# Altium schematic sheet 02_power.SchDoc: Power
size A3; SheetNumber: 3; SheetTotal: 10
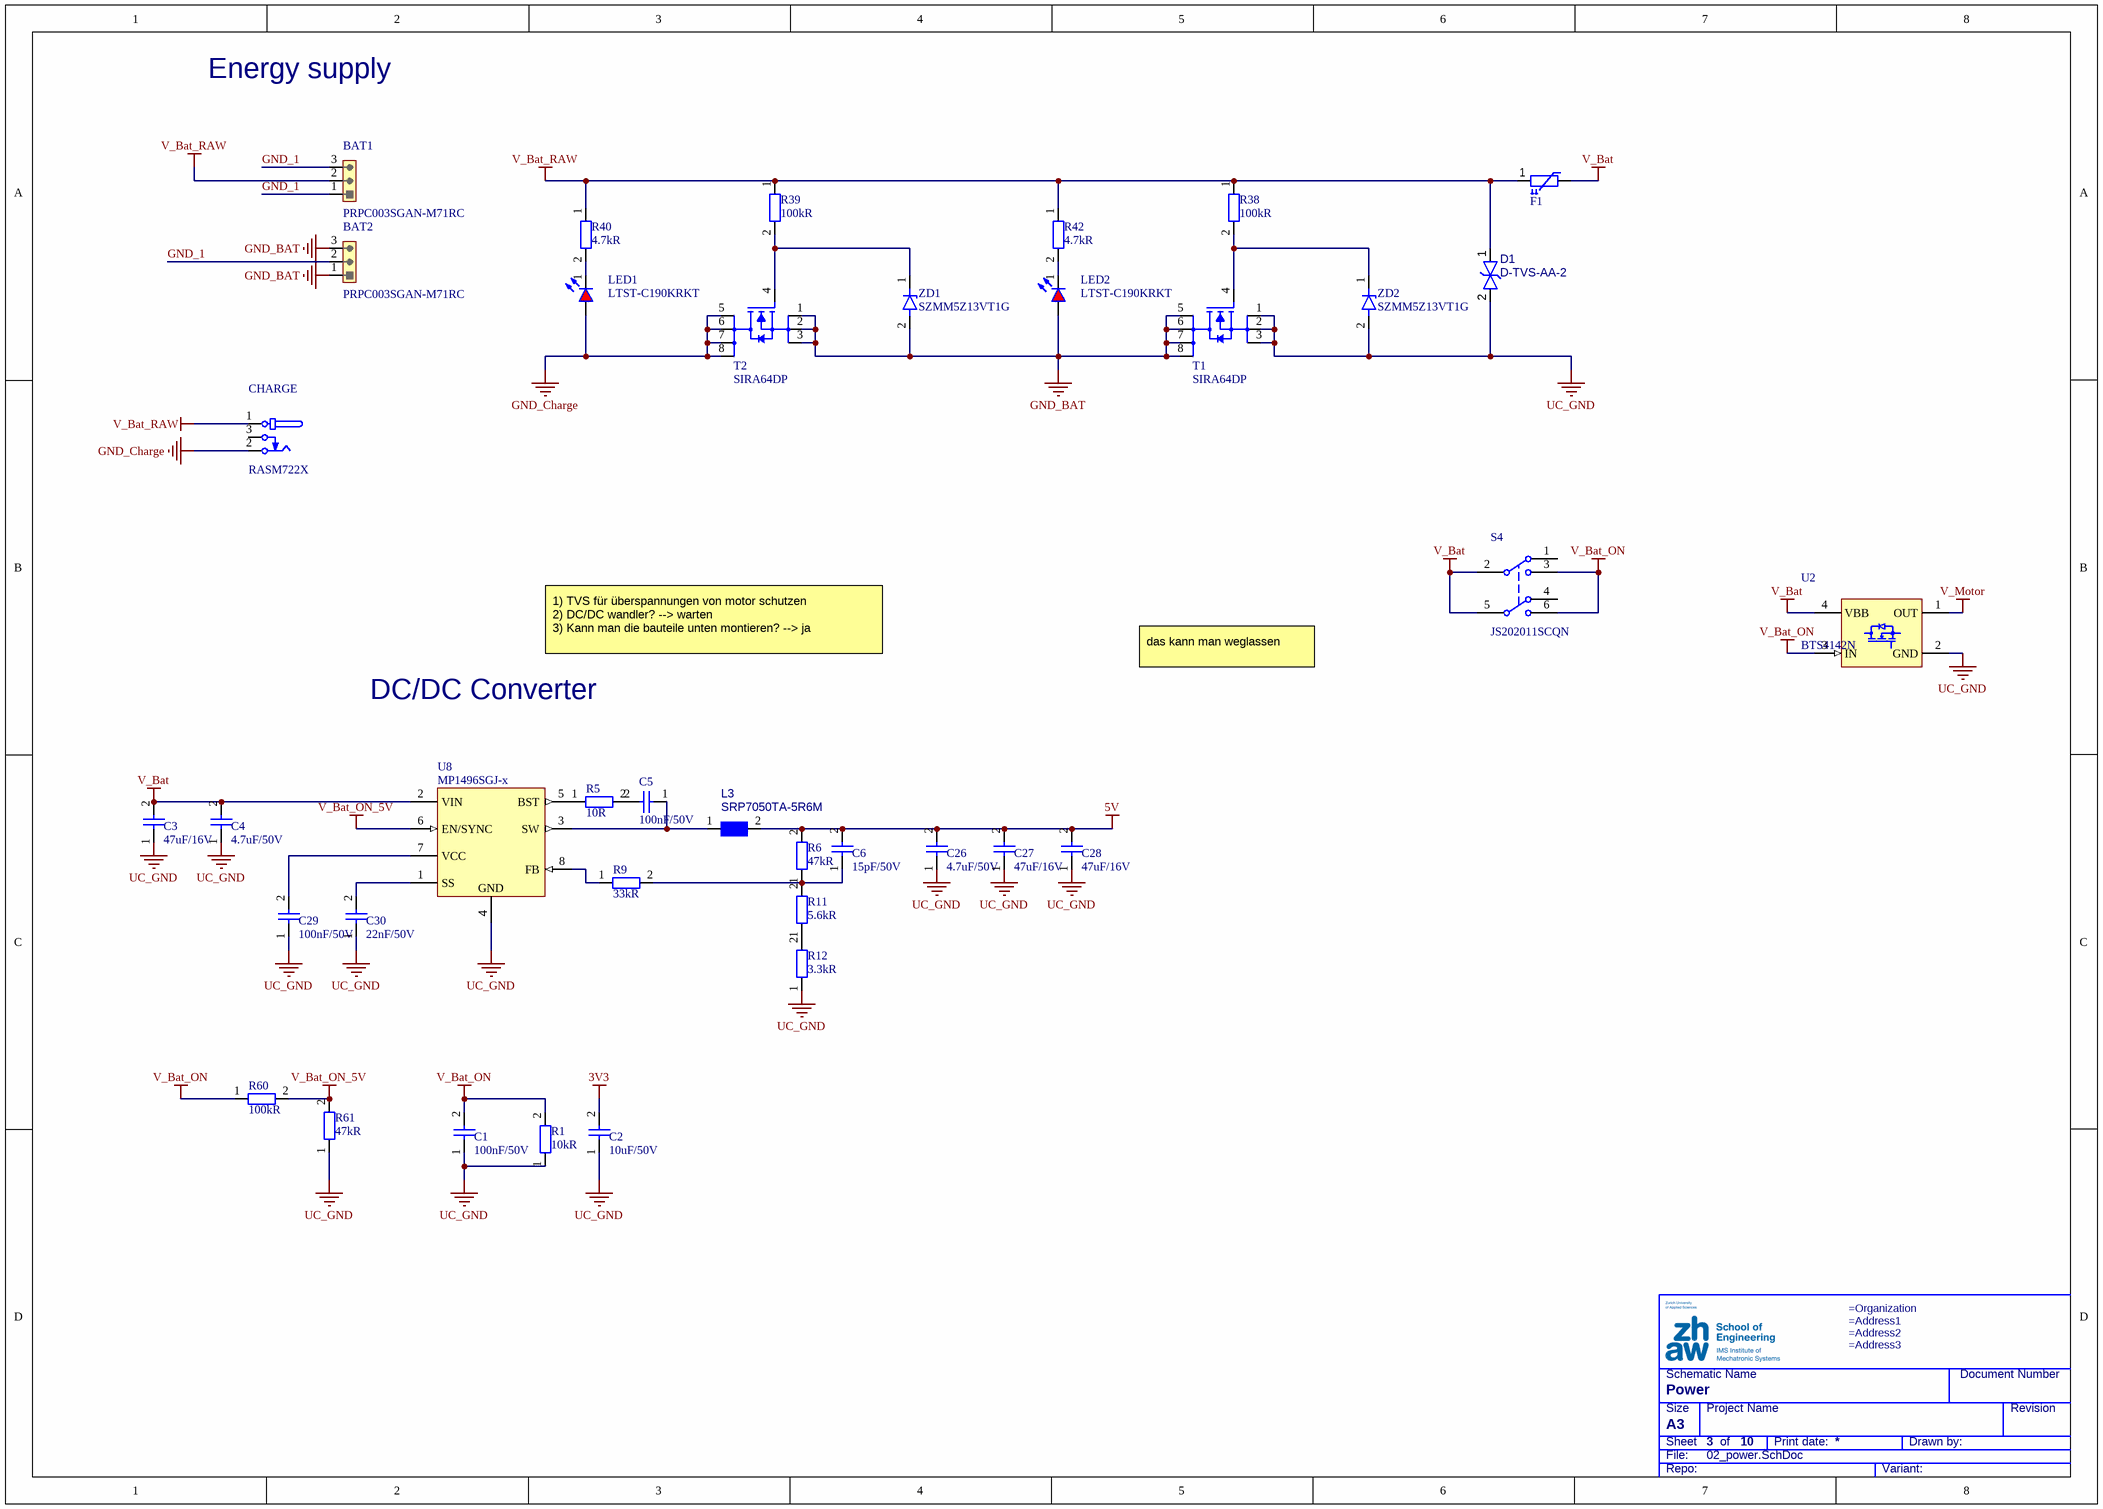
[diagram p0: 02_power.SchDoc]

## Parts
BAT1  PRPC003SGAN-M71RC  [HD254_1x3_MH]
BAT2  PRPC003SGAN-M71RC  [HD254_1x3_MH]
C1  100nF/50V  [CAPC1005X05L]
C2  10uF/50V  [CAPC3216X12L]
C3  47uF/16V  [CAPC3225X25L]
C4  4.7uF/50V  [CAPC2012X15L]
C5  100nF/50V  [CAPC1005X05L]
C6  15pF/50V  [CAPC1005X05L]
C26  4.7uF/50V  [CAPC2012X15L]
C27  47uF/16V  [CAPC3225X25L]
C28  47uF/16V  [CAPC3225X25L]
C29  100nF/50V  [CAPC1005X05L]
C30  22nF/50V  [CAPC1005X05L]
CHARGE  RASM722X  [SWITCHCRAFT_RASM722X]
D1  D-TVS-AA-2  [DIOM4436X26L]
F1  1210L050YR  [FUSER_1210LXXX_H85]  (value not drawn)
L3  SRP7050TA-5R6M  [FP-SRP7050TA-MFG]
LED1  LTST-C190KRKT  [LEDSC160X80X80-2Lrd]
LED2  LTST-C190KRKT  [LEDSC160X80X80-2Lrd]
R1  10kR  [RESC1005X04L]
R5  10R  [RESC1005X04L]
R6  47kR  [RESC1005X04L]
R9  33kR  [RESC1005X04L]
R11  5.6kR  [RESC1005X04L]
R12  3.3kR  [RESC1005X04L]
R38  100kR  [RESC1005X04L]
R39  100kR  [RESC1005X04L]
R40  4.7kR  [RESC1005X04L]
R42  4.7kR  [RESC1005X04L]
R60  100kR  [RESC1005X04L]
R61  47kR  [RESC1005X04L]
S4  JS202011SCQN  [SW_JS202011SCQN]
T1  SIRA64DP  [SON127P615X515X110-8N]
T2  SIRA64DP  [SON127P615X515X110-8N]
U2  BTS4142N  [SOT230P700X180-4L]
U8  MP1496SGJ-x  [TSOP65P280X100-8L]
ZD1  SZMM5Z13VT1G  [SODFL160X70-2L]
ZD2  SZMM5Z13VT1G  [SODFL160X70-2L]

## Nets
3V3: C2.2
5V: C6.2 C26.2 C27.2 C28.2 L3.2 R6.2
GND_BAT: BAT2.1 BAT2.3 LED2.2(A) T1.5(D) T1.6(D) T1.7(D) T1.8(D) T2.1(S) T2.2(S) T2.3(S) ZD1.2(Anode)
GND_Charge: CHARGE.2(TIP) LED1.2(A) T2.5(D) T2.6(D) T2.7(D) T2.8(D)
UC_GND: C1.1 C2.1 C3.1 C4.1 C26.1 C27.1 C28.1 C29.1 C30.1 D1.2(A) R1.1 R12.1 R61.1 T1.1(S) T1.2(S) T1.3(S) U2.2(GND) U8.4(GND) ZD2.2(Anode)
V_Bat: C3.2 C4.2 F1.2 S4.2 S4.5 U2.4(VBB) U8.2(VIN)
V_Bat_ON: C1.2 R1.2 R60.1 S4.3 S4.6 U2.3(IN)
V_Bat_ON_5V: R60.2 R61.2 U8.6(EN/SYNC)
V_Bat_RAW: BAT1.2 CHARGE.1(SLEEVE) D1.1(A) F1.1 R38.1 R39.1 R40.1 R42.1
V_Motor: U2.1(OUT)
GND_1: BAT1.1 BAT1.3 BAT2.2
NetC5_1: C5.1 L3.1 U8.3(SW)
NetC5_2: C5.2 R5.2
NetC6_1: C6.1 R6.1 R9.2 R11.2
NetC29_2: C29.2 U8.7(VCC)
NetC30_2: C30.2 U8.1(SS)
NetLED1_1: LED1.1(K) R40.2
NetLED2_1: LED2.1(K) R42.2
NetR5_1: R5.1 U8.5(BST)
NetR9_1: R9.1 U8.8(FB)
NetR11_1: R11.1 R12.2
NetR38_2: R38.2 T1.4(G) ZD2.1(Cathode)
NetR39_2: R39.2 T2.4(G) ZD1.1(Cathode)

Not connected (* = marked no-connect by the designer): CHARGE 3(SHUNT); S4 1 4

## Notes on the sheet
- Energy supply
- 1)	TVS für überspannungen von motor schutzen
  2)	DC/DC wandler? --> warten
  3)	Kann man die bauteile unten montieren? --> ja
- DC/DC Converter
- das kann man weglassen
- Schematic Name
- Document Number
- File:
- Sheet
- Size
- A3
- Project Name
- of
- Print date:
- Drawn by:
- Revision
- Repo:
- Variant:

## Library data of the parts
BAT1 BAT2 = CMP-002-00172-16: Header, 1x3Pin, Pitch 2.54mm, Male, Horizontal, THT; Manufacturer: Sullins Connector Solutions; Mating Length: 8.08m; Overall Contact Length: 0mm; Pin Mapping: 1x3; Angle: Horizontal; Gender: Male; Insulation Height: 2.5mm; Mounting Technology: THT; Pins: 3; Pitch: 2.54mm; Pitch Row: 2.54mm; Termination Length: 3.05mm
C1 C5 C29 = CMP-001-00067-18: Cap MLCC, 100nF, 50V, X7R, 10%, 0402; Value: 100nF; Case/Package: 0402; Case Code (Metric): 1005; Dielectricum: X7R; Mounting Technology: SMD; Tolerance: 10%; Type: MLCC; Voltage Rating: 50V
C2 = CMP-001-00092-17: Cap MLCC, 10uF, 50V, X5R, 10%, 1206; Value: 10µF; Case/Package: 1206; Case Code (Metric): 3216; Dielectricum: X5R; Mounting Technology: SMD; Tolerance: 10%; Type: MLCC; Voltage Rating: 50V
C3 C27 C28 = CMP-001-00097-16: Cap MLCC, 47uF, 16V, X5R, 20%, 1210; Value: 47µF; Type: MLCC; Case/Package: 1210; Case Code (Metric): 3525; Dielectricum: X5R; Mounting Technology: SMD; Tolerance: 20%; Voltage Rating: 16V
C4 C26 = CMP-00016-9: Cap MLCC, 4.7uF, 50V, X5R, 10%, 0805; Designator: C; Value: 4.7µF; Case/Package: 0805; Case Code (Metric): 2012; Dielectricum: X5R; Mounting Technology: SMD; Tolerance: 10%; Type: MLCC; Voltage Rating: 50V
C6 = CMP-00153-5: Cap MLCC, 15pF, 50V, C0G, 5%, 0402; Designator: C; Type: MLCC; Case/Package: 0402; Case Code (Metric): 1005; Dielectricum: C0G; Mounting Technology: SMD; Tolerance: 5%; Value: 15pF; Voltage Rating: 50V
C30 = CMP-001-00062-18: Cap MLCC, 22nF, 50V, X7R, 10%, 0402; Type: MLCC; Case/Package: 0402; Case Code (Metric): 1005; Dielectricum: X7R; Mounting Technology: SMD; Tolerance: 10%; Value: 22nF; Voltage Rating: 50V
CHARGE = CMP-002-00013-19: Barrel Power Jack, 3 Pin, Male, 5A, 250V, Horizontal, SMD, L14.5B9H11; Manufacturer: Switchcraft; Connection: Pluggable; Pin Mapping: 2+1; Pitch: 0mm; Type: Jack; Angle: Horizontal; Gender: Male; Max Current: 5A; Max Voltage: 250V; Mounting Technology: SMD; Pins: 3; Size: L14.5B9H11
D1 = CMP-004-00103-1: TVS Diode, bidirectional, 54V, 6.9A, 600W, SMB-2; Connection: single; Direction: Unidirectional; Case/Package: SMB-2; Mounting Technology: SMD; Peak Current: 6.9A; Peak Power: 600W; Rated Voltage: 54V
F1 = CMP-00093-7: Resettable Fuse, Ihold 500mA, Itrip 1A, 13.2V, 1210; Case/Package: 1210; Ihold: 500mA; Itrip: 1A; Mounting Technology: SMD; Voltage Rating: 13.2V
L3 = CMP-006-00040-5: Coil, 5.6uH, 49mR, 6A, 20%, 6A, 2626; Inductivity: 5.6µH; Resistance DC: 49m; Case/Package: 2626; Current: 6A; Mounting Technology: SMD; Tolerance: 20%
LED1 LED2 = CMP-007-00024-12: LED, Red, 20mA, 2.0V, 0603; Designator: LD; Forward Voltage: 2V; Case/Package: 0603; Color: Red; Mounting Technology: SMD; Rated Current: 20mA; Size: L1.6B0.8H0.8
R1 = CMP-009-00149-32: Res, 10kR, 1%, 0.1W, 0402; Value: 10k; Power: 100mW; Voltage Rating: 50V; Case/Package: 0402; Case Code (Metric): 1005; Mounting Technology: SMD; Tolerance: 1%; Type: Fixed
R5 = CMP-009-00152-29: Res, 10R, 1%, 0.063W, 0402; Power: 63mW; Value: 10; Voltage Rating: 50V; Type: Fixed; Case/Package: 0402; Case Code (Metric): 1005; Mounting Technology: SMD; Tolerance: 1%
R6 R61 = CMP-009-00137-31: Res, 47kR, 1%, 0.063W, 0402; Value: 47k; Power: 63mW; Voltage Rating: 50V; Case/Package: 0402; Case Code (Metric): 1005; Mounting Technology: SMD; Tolerance: 1%; Type: Fixed
R9 = CMP-009-00028-32: Res, 33kR, 1%, 0.063W, 0402; Power: 63mW; Value: 33k; Voltage Rating: 50V; Type: Fixed; Case/Package: 0402; Case Code (Metric): 1005; Mounting Technology: SMD; Tolerance: 1%
R11 = CMP-009-00136-30: Res, 5.6kR, 1%, 0.063W, 0402; Value: 5.6k; Power: 63mW; Voltage Rating: 50V; Case/Package: 0402; Case Code (Metric): 1005; Mounting Technology: SMD; Tolerance: 1%; Type: Fixed
R12 = CMP-009-00085-21: Res, 3.3kR, 1%, 0.063W, 0402; Value: 3.3k; Power: 63mW; Voltage Rating: 50V; Case/Package: 0402; Case Code (Metric): 1005; Mounting Technology: SMD; Tolerance: 1%; Type: Fixed
R38 R39 = CMP-009-00022-32: Res, 100kR, 1%, 0.1W, 0402; Designator: R; Value: 100k; Power: 100mW; Voltage Rating: 50V; Case/Package: 0402; Case Code (Metric): 1005; Mounting Technology: SMD; Tolerance: 1%; Type: Fixed
R40 R42 = CMP-009-00030-32: Res, 4.7kR, 1%, 0.1W, 0402; Designator: R; Value: 4.7k; Power: 100mW; Voltage Rating: 50V; Case/Package: 0402; Case Code (Metric): 1005; Mounting Technology: SMD; Tolerance: 1%; Type: Fixed
R60 = CMP-009-00022-32: Res, 100kR, 1%, 0.1W, 0402; Value: 100k; Power: 100mW; Voltage Rating: 50V; Case/Package: 0402; Case Code (Metric): 1005; Mounting Technology: SMD; Tolerance: 1%; Type: Fixed
S4 = CMP-011-00022-7: Slide Switch, Vertical, DPDT, 30V, 100mA, L9B3H3.5; Illuminated: No; Actuation: Slide; Angle: Vertical; Contact Form: DPDT; Contact Material: Copper Alloy; Current Rating: 100mA; Mounting Technology: SMD; Size: L9B3H3.5; Type: Switch; Voltage Rating: 30V
T1 T2 = CMP-013-00069-13: MOSFET N-Enh, 30V, 60A, 100Ap, 2.1mR, 27.8W, SO-8; Current peak: 100A; Resistance: 2.1m; Type: MOSFET; Case/Package: PowerPAK-SO-8; Current: 60A; Mounting Technology: SMD; Power: 27.8W; Technology: N-enh; Voltage: 30V
U2 = CMP-013-00047-14: High-Side Switch, 1 Ch, 12..45V, 1.4A, SOT-223-4; Channels: 1; Max Logic Voltage: 12V; Min Logic Voltage: 45V; Case/Package: SOT-223-4; Function: High-Side Switch; Max Current: 1.4A; Mounting Technology: SMD
U8 = CMP-00363-3: Buck Converter, 0.8..15.2V, 2A, 4.5..16Vin, SOT23-8; Frequency: 500kHz; Max In Voltage: 16V; Max Out Voltage: 15.2V; Min In Voltage: 4.5V; Min Out Voltage: 800mV; Case/Package: VSSOP; Max Out Current: 2A; Mounting Technology: SMD
ZD1 ZD2 = CMP-004-00080-9: Zener Diode, 13.25V±0.85V, 5mA, 30R, 500mW, SOD-523-2; Designator: ZD; Current: 100nA; Voltage: 13.25V; Case/Package: SOD-523-2; Mounting Technology: SMD; Power: 500mW; Type: Zener